# EAGLE design schematic (EAGLE 6.5.0)
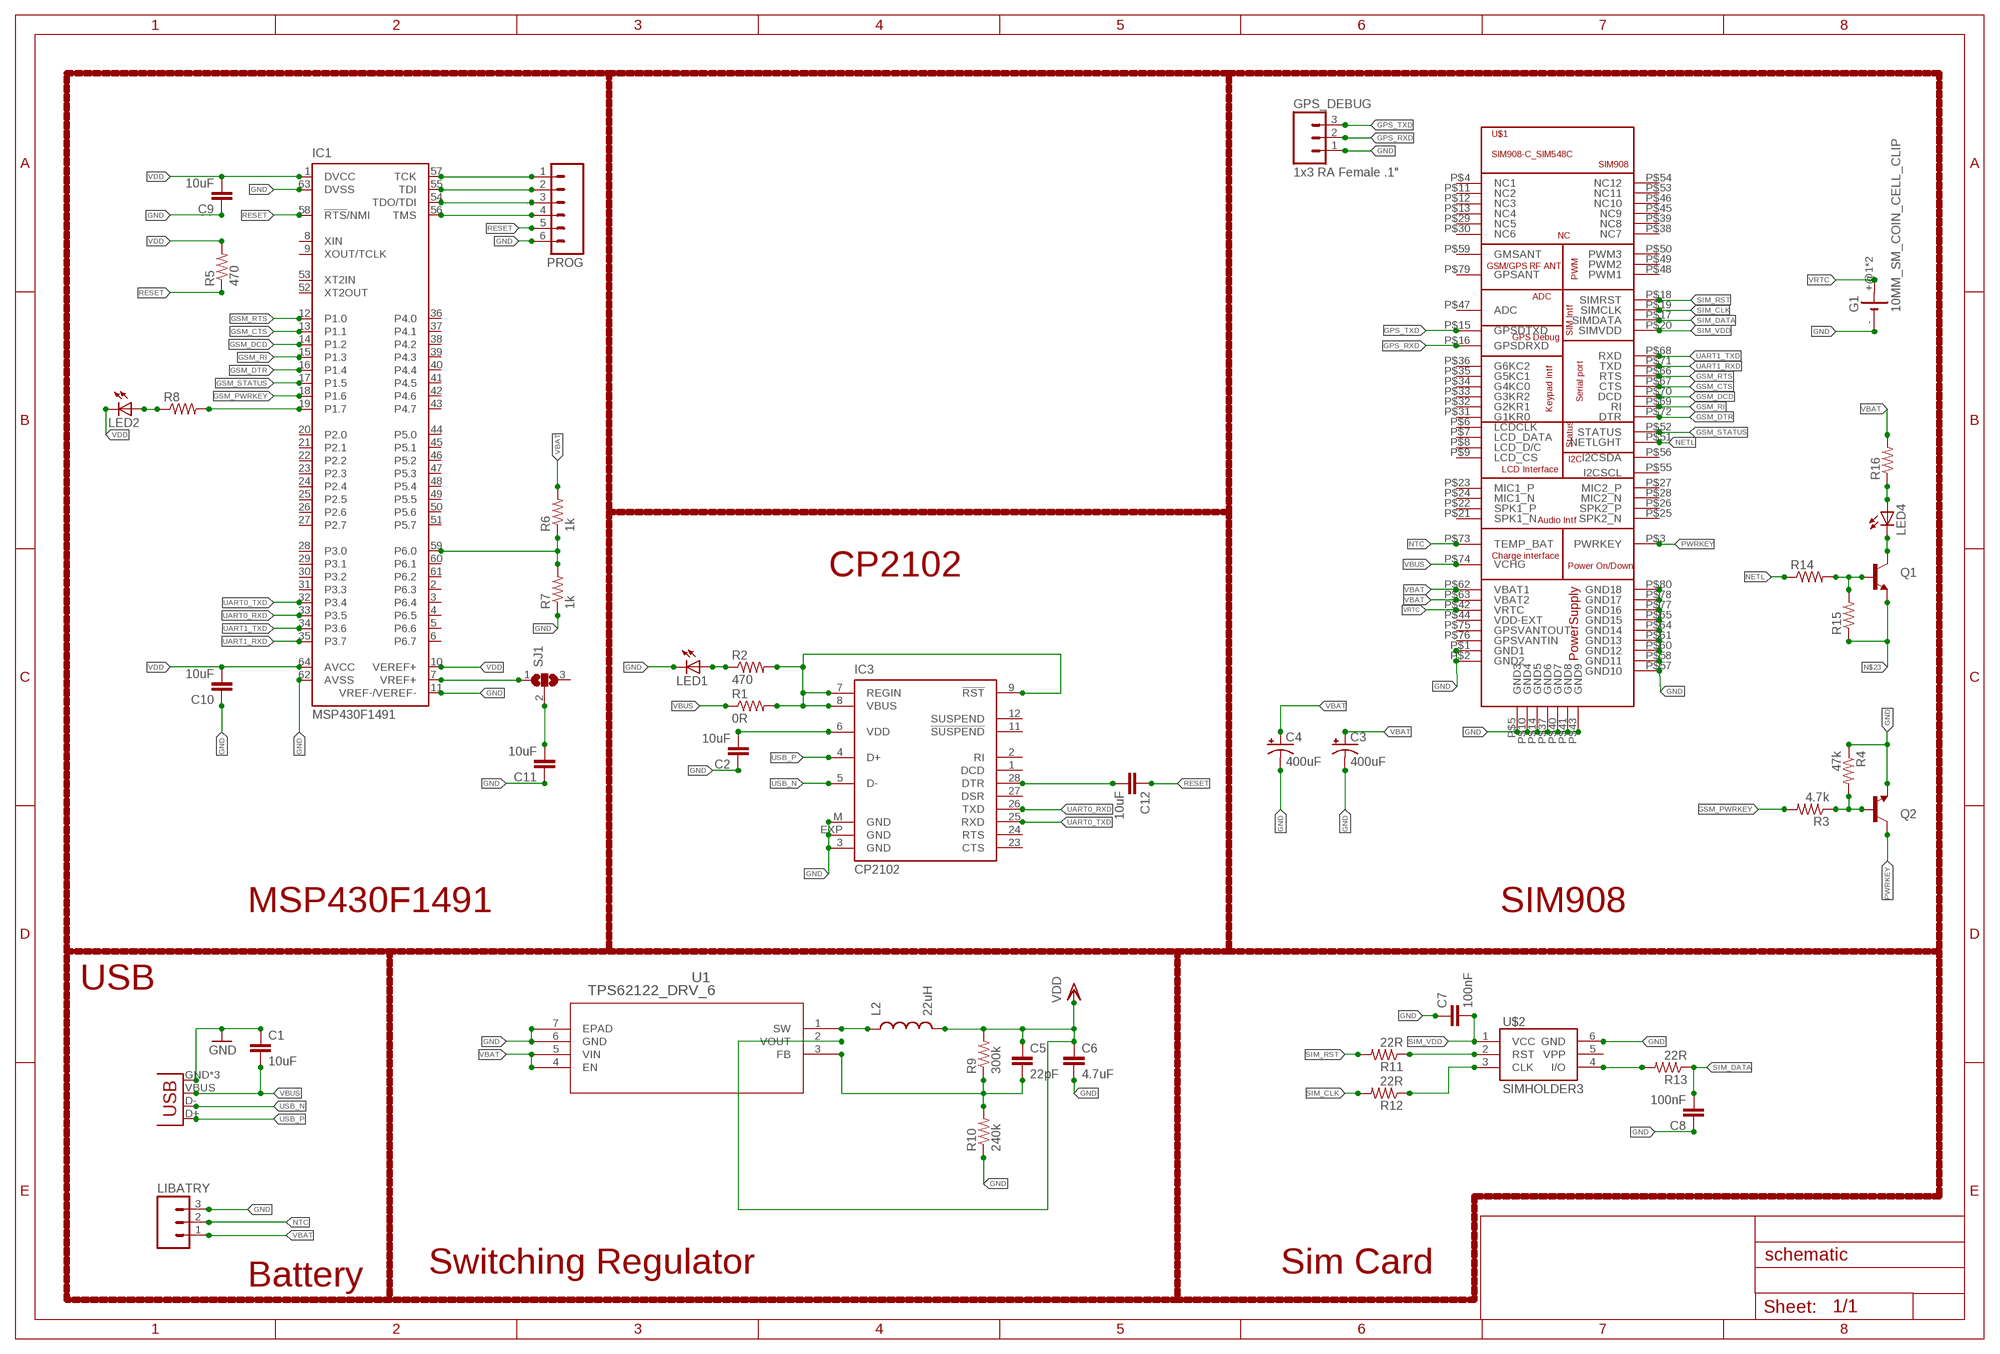
[diagram p0: schematic, sheet 1]

## Parts
C1  10uF  CAP0402-CAP  [0402-CAP]
C2  10uF  CAP0402-CAP  [0402-CAP]
C3  400uF  CAP_POLG  [PANASONIC_G]
C4  400uF  CAP_POLG  [PANASONIC_G]
C5  22pF  CAP0402-CAP  [0402-CAP]
C6  4.7uF  CAP0402-CAP  [0402-CAP]
C7  100nF  CAP0402-CAP  [0402-CAP]
C8  100nF  CAP0402-CAP  [0402-CAP]
C9  10uF  CAP0402-CAP  [0402-CAP]
C10  10uF  CAP0402-CAP  [0402-CAP]
C11  10uF  CAP0402-CAP  [0402-CAP]
C12  10uF  CAP0402-CAP  [0402-CAP]
G1  10MM_SM_COIN_CELL_CLIP  [10MM_SM_COIN_CELL_CLIP]
GPS_DEBUG  1x3 RA Female .1"  M03SMD_RA_FEMALE  [1X03_SMD_RA_FEMALE]
IC1  MSP430F1491  [SQFP-S-10X10-64]
IC3  CP2102  [MLP28]
JP1  USB-MICROB  [USB-MICROB]
L2  22uH  INDUCTOR0402  [C0402]
LED1  LEDSML0603  [SML0603]
LED2  LEDSML0603  [SML0603]
LED4  LEDSML0603  [SML0603]
LIBATRY  M03PTH  [1X03]
PROG  M06SMD-STRAIGHT  [1X06_SMD_STRAIGHT]
Q1  TRANSISTOR_NPNSOT23  [SOT23]
Q2  TRANSISTOR_NPNSOT23  [SOT23]
R1  0R  RESISTOR0402-RES  [0402-RES]
R2  470  RESISTOR0402-RES  [0402-RES]
R3  4.7k  RESISTOR0402-RES  [0402-RES]
R4  47k  RESISTOR0402-RES  [0402-RES]
R5  470  RESISTOR0402-RES  [0402-RES]
R6  1k  RESISTOR0402-RES  [0402-RES]
R7  1k  RESISTOR0402-RES  [0402-RES]
R8  RESISTOR0402-RES  [0402-RES]
R9  300k  RESISTOR0402-RES  [0402-RES]
R10  240k  RESISTOR0402-RES  [0402-RES]
R11  22R  RESISTOR0402-RES  [0402-RES]
R12  22R  RESISTOR0402-RES  [0402-RES]
R13  22R  RESISTOR0402-RES  [0402-RES]
R14  RESISTOR0402-RES  [0402-RES]
R15  RESISTOR0402-RES  [0402-RES]
R16  RESISTOR0402-RES  [0402-RES]
SJ1  SJ2W  [SJ_2]
U1  TPS62122_DRV_6  [DRV6_1P6X1]
U$1  SIM908-C_SIM548C  [SIM908-C_SIM548C]
U$2  SIMHOLDER3  [SIMHOLDER3]

## Nets
GND: C1.1 C2.1 C3.- C4.- C6.2 C7.1 C8.1 C9.1 C10.1 C11.1 G1.- GPS_DEBUG.1 IC1.11(VREF-/VEREF-) IC1.62(AVSS) IC1.63(DVSS) IC3.3(GND) IC3.EXP(GND) IC3.M(GND) JP1.GND JP1.MT1(GND) JP1.MT2(GND) LED1.C LIBATRY.3 PROG.6 Q2.2(E) R4.1 R7.1 R10.1 U1.6(GND) U1.7(EPAD) U$1.P$1(GND1) U$1.P$2(GND2) U$1.P$5(GND3) U$1.P$10(GND4) U$1.P$14(GND5) U$1.P$37(GND6) U$1.P$40(GND7) U$1.P$41(GND8) U$1.P$43(GND9) U$1.P$57(GND10) U$1.P$58(GND11) U$1.P$60(GND12) U$1.P$61(GND13) U$1.P$64(GND14) U$1.P$65(GND15) U$1.P$77(GND16) U$1.P$78(GND17) U$1.P$80(GND18) U$2.6(GND)
GPS_RXD: GPS_DEBUG.2 U$1.P$16(GPSDRXD)
GPS_TXD: GPS_DEBUG.3 U$1.P$15(GPSDTXD)
GSM_CTS: IC1.13(P1.1) U$1.P$67(CTS)
GSM_DCD: IC1.14(P1.2) U$1.P$70(DCD)
GSM_DTR: IC1.16(P1.4) U$1.P$72(DTR)
GSM_PWRKEY: IC1.18(P1.6) R3.2
GSM_RI: IC1.15(P1.3) U$1.P$69(RI)
GSM_RTS: IC1.12(P1.0) U$1.P$66(RTS)
GSM_STATUS: IC1.17(P1.5) U$1.P$52(STATUS)
N$1: IC1.57(TCK) PROG.1
N$2: IC1.7(VREF+) SJ1.1
N$3: IC1.55(TDI) PROG.2
N$4: LED4.C Q1.3(C)
N$5: LED1.A R2.1
N$6: IC1.54(TDO/TDI) PROG.3
N$7: LED4.A R16.1
N$8: Q2.1(B) R3.1 R4.2
N$9: IC1.56(TMS) PROG.4
N$10: R11.1 U$2.2(RST)
N$11: C2.2 IC3.6(VDD)
N$12: L2.1 U1.1(SW)
N$13: LED2.A R8.1
N$14: C11.2 SJ1.2
N$15: IC3.7(REGIN) IC3.8(VBUS) IC3.9(!RST) R1.2 R2.2
N$16: R12.1 U$2.3(CLK)
N$17: R13.2 U$2.4(I/O)
N$19: C5.2 R9.1 R10.2 U1.3(FB)
N$20: IC1.59(P6.0) R6.1 R7.2
N$21: C12.2 IC3.28(DTR)
N$23: Q1.2(E) R15.1
N$24: Q1.1(B) R14.2 R15.2
N$25: IC1.19(P1.7) R8.2
NETL: R14.1 U$1.P$51(NETLGHT)
NTC: LIBATRY.2 U$1.P$73(TEMP_BAT)
PWRKEY: Q2.3(C) U$1.P$3(PWRKEY)
RESET: C12.1 IC1.58(!RTS!/NMI) PROG.5 R5.1
SIM_CLK: R12.2 U$1.P$19(SIMCLK)
SIM_DATA: C8.2 R13.1 U$1.P$17(SIMDATA)
SIM_RST: R11.2 U$1.P$18(SIMRST)
SIM_VDD: C7.2 U$1.P$20(SIMVDD) U$2.1(VCC)
UART0_RXD: IC1.33(P3.5) IC3.26(TXD)
UART0_TXD: IC1.32(P3.4) IC3.25(RXD)
UART1_RXD: IC1.35(P3.7) U$1.P$71(TXD)
UART1_TXD: IC1.34(P3.6) U$1.P$68(RXD)
USB_N: IC3.5(D-) JP1.D-
USB_P: IC3.4(D+) JP1.D+
VBAT: C3.+ C4.+ LIBATRY.1 R6.2 R16.2 U1.4(EN) U1.5(VIN) U$1.P$62(VBAT1) U$1.P$63(VBAT2)
VBUS: C1.2 JP1.VBUS R1.1 U$1.P$74(VCHG)
VDD: C5.1 C6.1 C9.2 C10.2 IC1.1(DVCC) IC1.10(VEREF+) IC1.64(AVCC) L2.2 LED2.C R5.2 R9.2 U1.2(VOUT)
VRTC: G1.+@1(+) G1.+@2(+) U$1.P$42(VRTC)
Unconnected: IC1.2(P6.3) IC1.3(P6.4) IC1.4(P6.5) IC1.5(P6.6) IC1.6(P6.7) IC1.8(XIN) IC1.9(XOUT/TCLK) IC1.20(P2.0) IC1.21(P2.1) IC1.22(P2.2) IC1.23(P2.3) IC1.24(P2.4) IC1.25(P2.5) IC1.26(P2.6) IC1.27(P2.7) IC1.28(P3.0) IC1.29(P3.1) IC1.30(P3.2) IC1.31(P3.3) IC1.36(P4.0) IC1.37(P4.1) IC1.38(P4.2) IC1.39(P4.3) IC1.40(P4.4) IC1.41(P4.5) IC1.42(P4.6) IC1.43(P4.7) IC1.44(P5.0) IC1.45(P5.1) IC1.46(P5.2) IC1.47(P5.3) IC1.48(P5.4) IC1.49(P5.5) IC1.50(P5.6) IC1.51(P5.7) IC1.52(XT2OUT) IC1.53(XT2IN) IC1.60(P6.1) IC1.61(P6.2) IC3.1(DCD) IC3.2(RI) IC3.11(!SUSPEND) IC3.12(SUSPEND) IC3.23(CTS) IC3.24(RTS) IC3.27(DSR) SJ1.3 U$1.P$4(NC1) U$1.P$6(LCDCLK) U$1.P$7(LCD_DATA) U$1.P$8(LCD_D/C) U$1.P$9(LCD_CS) U$1.P$11(NC2) U$1.P$12(NC3) U$1.P$13(NC4) U$1.P$21(SPK1_N) U$1.P$22(SPK1_P) U$1.P$23(MIC1_P) U$1.P$24(MIC1_N) U$1.P$25(SPK2_N) U$1.P$26(SPK2_P) U$1.P$27(MIC2_P) U$1.P$28(MIC2_N) U$1.P$29(NC5) U$1.P$30(NC6) U$1.P$31(G1KR0) U$1.P$32(G2KR1) U$1.P$33(G3KR2) U$1.P$34(G4KC0) U$1.P$35(G5KC1) U$1.P$36(G6KC2) U$1.P$38(NC7) U$1.P$39(NC8) U$1.P$44(VDD-EXT) U$1.P$45(NC9) U$1.P$46(NC10) U$1.P$47(ADC) U$1.P$48(PWM1) U$1.P$49(PWM2) U$1.P$50(PWM3) U$1.P$53(NC11) U$1.P$54(NC12) U$1.P$55(I2CSCL) U$1.P$56(I2CSDA) U$1.P$59(GMSANT) U$1.P$75(GPSVANTOUT) U$1.P$76(GPSVANTIN) U$1.P$79(GPSANT) U$2.5(VPP)

## Notes on the sheet
- CP2102
- MSP430F1491 | SIM908
- USB
- Switching Regulator | Sim Card
- Battery

## Library data of the parts
C1 C2 C5-C12 = SparkFun-Capacitors:CAP: Capacitor Standard 0603 ceramic capacitor, and 0.1" leaded capacitor.
C3 C4 = SparkFun-Capacitors:CAP_POL: Capacitor Polarized These are standard SMD and PTH capacitors. Normally 10uF, 47uF, and 100uF in electrolytic and tantalum varieties. Always verify the external diameter of the through hole cap, it varies with capacity, voltage, and manufacturer. The EIA devices should be standard.
G1 = battery:10MM_SM_COIN_CELL_CLIP: Battery cell clip for CR927 Source: KEYSTONE ELECTRONICS CORP. www.keyelco.com, ASTORIA, N.Y. 11105-2017 PART ANME 10mm SM COIN CELl CLIP DWG NO. 3030
GPS_DEBUG = SparkFun-Connectors:M03: Header 3 Standard 3-pin 0.1" header. Use with straight break away headers (SKU : PRT-00116), right angle break away headers (PRT-00553), swiss pins (PRT-00743), machine pins (PRT-00117), and female headers (PRT-00115). Molex polarized connector foot print use with SKU : PRT-08232 with associated crimp pins and housings.; PROD_ID: CONN-10926
IC1 = texas:MSP430F1*: MIXED SIGNAL MICROCONTROLLER Family Members Include: - MSP430F133: 8KB+256B Flash Memory, 256B RAM - MSP430F135: 16KB+256B Flash Memory, 512B RAM - MSP430F147, MSP430F1471: 32KB+256B Flash Memory, 1KB RAM - MSP430F148, MSP430F1481: 48KB+256B Flash Memory, 2KB RAM - MSP430F149, MSP430F1491: 60KB+256B Flash Memory, 2KB RAM; MF: TEXAS INSTRUMENT CONNECTORS; MPN: MSP430F1491IPM; OC_FARNELL: 1537169; OC_NEWARK: 34K8186
IC3 = silabs:CP210*: Single-Chip USB to UART Bridge Source: www.silabs.com .. CP2101.pdf / cp2102.pdf; MF: FARNELL; MPN: CP2102-GM; OC_FARNELL: 9282130; OC_NEWARK: 30K5635
JP1 = SparkFun-Connectors:USB: USB Connectors USB-B-PTH is fully proven SKU : PRT-00139/CONN-08278 USB-miniB is fully proven SKU : PRT-00587 USB-A-PCB is untested. USB-A-H is throughly reviewed, but untested. Spark Fun Electronics SKU : PRT-00437 USB-B-SMT is throughly reviewed, but untested. Needs silkscreen touching up. USB-A-S has not been used/tested USB-MB-H has not been used/tested USB-MICROB has been used. CONN-09505; PROD_ID: CONN-09505
L2 = SparkFun-Passives:INDUCTOR: Inductors Basic Inductor/Choke - 0603 and 1206. Footprints are not proven and vary greatly between part numbers. SRN6045- 33uH, 20% 1.4A SDR0403-560KL - 56uH, 10%, 500mA RMS/740mA peak
LED1 LED2 LED4 = led:LED: LED OSRAM: - CHIPLED LG R971, LG N971, LY N971, LG Q971, LY Q971, LO R971, LY R971 LH N974, LH R974 LS Q976, LO Q976, LY Q976 LO Q996 - Hyper CHIPLED LW Q18S LB Q993, LB Q99A, LB R99A - SideLED LS A670, LO A670, LY A670, LG A670, LP A670 LB A673, LV A673, LT A673, LW A673 LH A674 LY A675 LS A676, LA A676, LO A676, LY A676, LW A676 LS A679, LY A679, LG A679 - Hyper Micro SIDELED® LS Y876, LA Y876, LO Y876, LY Y876 LT Y87S - SmartLED LW L88C, LW L88S LB L89C, LB L89S, LG L890 LS L89K, LO L89K, LY L89K LS L896, LA L896, LO L896, LY L896 - TOPLED LS T670, LO T670, LY T670, LG T670, LP T670 LSG T670, LSP T670, LSY T670, LOP T670, LYG T670 LG T671, LOG T671, LSG T671 LB T673, LV T673, LT T673, LW T673 LH T674 LS T676, LA T676, LO T676, LY T676, LB T676, LH T676, LSB T676, LW T676 LB T67C, LV T67C, LT T67C, LS T67K, LO T67K, LY T67K, LW E67C LS E67B, LA E67B, LO E67B, LY E67B, LB E67C, LV E67C, LT E67C LW T67C LS T679, LY T679, LG T679 LS T770, LO T770, LY T770, LG T770, LP T770 LB T773, LV T773, LT T773, LW T773 LH T774 LS E675, LA E675, LY E675, LS T675 LS T776, LA T776, LO T776, LY T776, LB T776 LHGB T686 LT T68C, LB T68C - Hyper Mini TOPLED® LB M676 - Mini TOPLED Santana® LG M470 LS M47K, LO M47K, LY M47K Source: http://www.osram.convergy.de LUXEON: - LUMILED® LXK2-PW12-R00, LXK2-PW12-S00, LXK2-PW14-U00, LXK2-PW14-V00 LXK2-PM12-R00, LXK2-PM12-S00, LXK2-PM14-U00 LXK2-PE12-Q00, LXK2-PE12-R00, LXK2-PE12-S00, LXK2-PE14-T00, LXK2-PE14-U00 LXK2-PB12-K00, LXK2-PB12-L00, LXK2-PB12-M00, LXK2-PB14-N00, LXK2-PB14-P00, LXK2-PB14-Q00 LXK2-PR12-L00, LXK2-PR12-M00, LXK2-PR14-Q00, LXK2-PR14-R00 LXK2-PD12-Q00, LXK2-PD12-R00, LXK2-PD12-S00 LXK2-PH12-R00, LXK2-PH12-S00 LXK2-PL12-P00, LXK2-PL12-Q00, LXK2-PL12-R00 Source: www.luxeon.com KINGBRIGHT: KA-3528ASYC Source: www.kingbright.com
LIBATRY = SparkFun-Connectors:M03: Header 3 Standard 3-pin 0.1" header. Use with straight break away headers (SKU : PRT-00116), right angle break away headers (PRT-00553), swiss pins (PRT-00743), machine pins (PRT-00117), and female headers (PRT-00115). Molex polarized connector foot print use with SKU : PRT-08232 with associated crimp pins and housings.
PROG = SparkFun-Connectors:M06: Header 6 Standard 6-pin 0.1" header. Use with straight break away headers (SKU : PRT-00116), right angle break away headers (PRT-00553), swiss pins (PRT-00743), machine pins (PRT-00117), and female headers (PRT-00115). Molex polarized connector foot print use with SKU : PRT-08094 with associated crimp pins and housings. NOTES ON THE VARIANTS LOCK and LOCK_LONGPADS... This footprint was designed to help hold the alignment of a through-hole component (i.e. 6-pin header) while soldering it into place. You may notice that each hole has been shifted either up or down by 0.005 of an inch from it's more standard position (which is a perfectly straight line). This slight alteration caused the pins (the squares in the middle) to touch the edges of the holes. Because they are alternating, it causes a "brace" to hold the component in place. 0.005 has proven to be the perfect amount of "off-center" position when using our standard breakaway headers. Although looks a little odd when you look at the bare footprint, once you have a header in there, the alteration is very hard to notice. Also,if you push a header all the way into place, it is covered up entirely on the bottom side. This idea of altering the position of holes to aid alignment will be further integrated into the Sparkfun Library for other footprints. It can help hold any component with 3 or more connection pins.
Q1 Q2 = SparkFun-DiscreteSemi:TRANSISTOR_NPN: Generic NPN BJT MMBT2222A - TRANS-08049 (SOT-23, 1A 40V) MPSA42 - TRANS-09116 (SOT-23, 500mA 300V) MMBT5088LT1G - TRANS-11160 (SOT-23, 50 mA 30V) BC547 - COM-08928 <http://www.sparkfun.com/products/8928> (TO-92 45V 100mA) (1.Collector 2.Base 3.Emitter) 2N3904 - COM-00521 <http://www.sparkfun.com/products/521> (TO-92 40V 200mA) (1.Emitter 2.Base 3.Collector) P2N2222A - COM-12852 <http://www.sparkfun.com/products/12852> (TO-92 40V 600mA) (1.Collector 2.Base 3.Emitter)
R1-R7 R14 R15 = SparkFun-Passives:RESISTOR: Resistor Basic schematic elements and footprints for 0603, 1206, and PTH resistors.
R8-R13 R16 = SparkFun:RESISTOR: Resistor Basic schematic elements and footprints for 0603, 1206, and PTH resistors.
SJ1 = jumper:SJ2W: SMD solder JUMPER
U1 = myTracelib:TPS62122_DRV_6; DATASHEETURL: http://www.ti.com/lit/gpn/TPS62122; DESCRIPTION: 15V, 75mA, 96% efficiency Step-Down Converter; FAMILY_NAME: STEP-DOWN REGULATOR; GENERIC_PART_NUMBER: TPS62122; INDUSTRY_STD_PKG_TYPE: SON; MANUFACTURER: Texas Instruments; MANUFACTURER_PART_NUMBER: tps62122_drv_6; PACKAGE_DESIGNATOR: DRV; PIN_COUNT: 6; VENDOR: Texas Instruments
U$1 = myTracelib:SIM908-C_SIM548C
U$2 = SparkFun-Connectors:SIMHOLDER3: Alternate SIM card socket

## Net classes
0 default: width 0.203 mm, drill 0.305 mm, clearance 0.152 mm

## Board
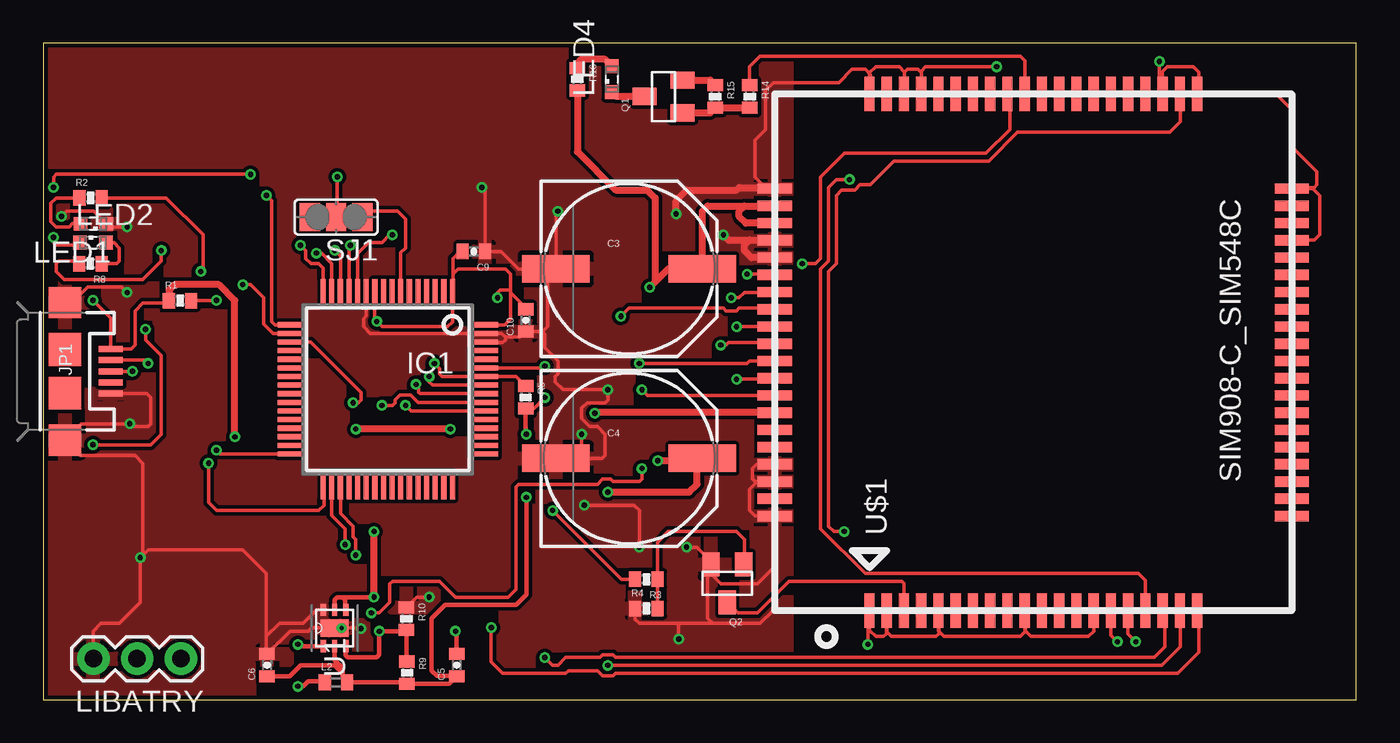
[diagram p1: board, top side]
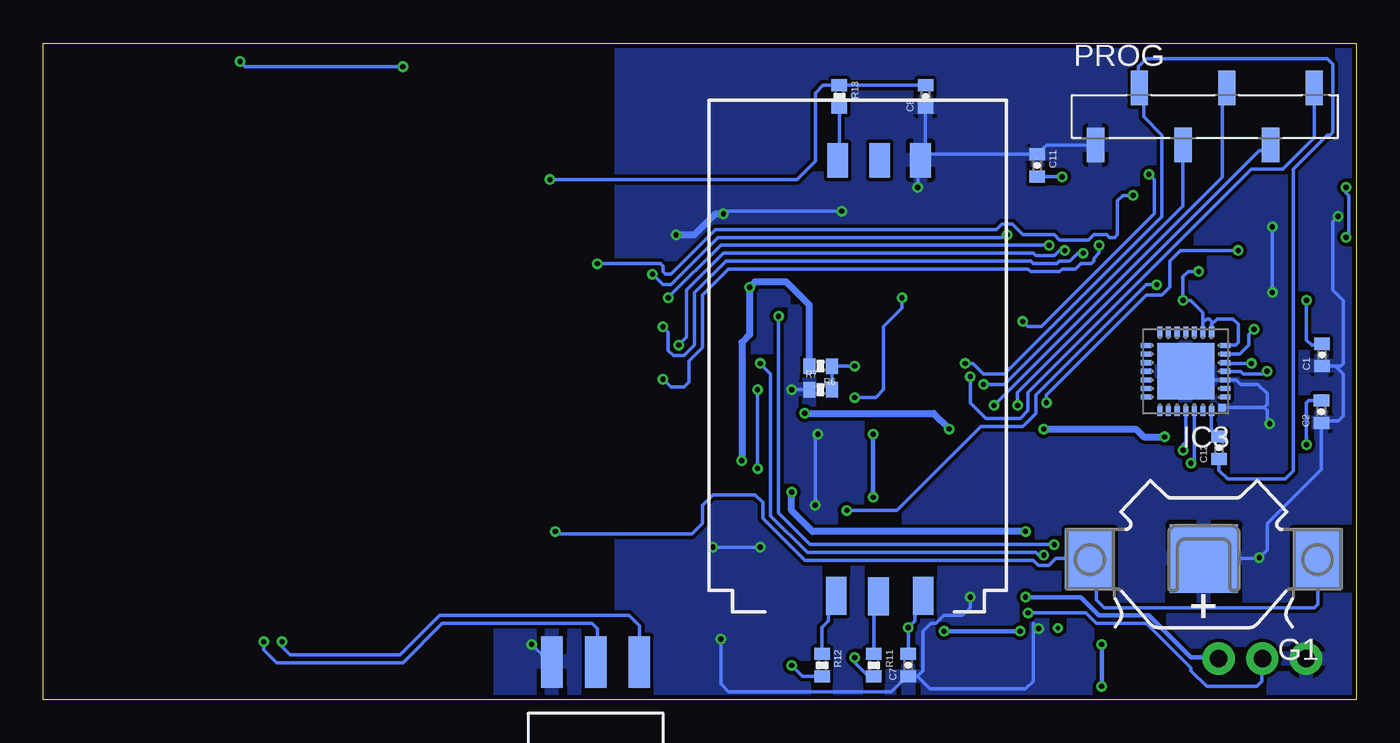
[diagram p2: board, bottom side, seen from below]

Size 76.2 x 38.1 mm. Coordinates in mm from the lower left corner, seen from the top.
Outline: 0,0 76.2,0 76.2,38.1 0,38.1 0,0
Copper layers (1*16): Top 0.035mm / dielectric 1.5mm / Bottom 0.035mm
Design rules "smart prototyping": minimum track width 6mil, minimum drill 12mil, track to track 6mil, track to pad 6mil, pad to pad 6mil, via to via 6mil, smd to smd 0mil, copper to edge 10mil, drill to drill 10mil, minimum pad ring 6mil, minimum via ring 6mil, stop-mask expansion 2mil, vias tented up to drill 25mil, thermal gap 10mil

### Footprints (pad centres in the part's own frame; a part is rotated, then mirrored left to right if it is on the bottom)
0402-CAP = smd 0.7 x 0.9: 1 -0.65,0; 2 0.65,0
PANASONIC_G = smd 3.9 x 1.6: + 4.25,0; - -4.25,0
10MM_SM_COIN_CELL_CLIP = smd 2.9 x 3.5: +@1 -6.6,0; +@2 6.6,0 | smd 3.96 x 3.96: - 0,0
1X03_SMD_RA_FEMALE = smd 1.25 x 3: 1 -2.54,7.225; 2 0,7.225; 3 2.54,7.225
SQFP-S-10X10-64 = smd 0.3 x 1.6: 1 -3.75,-5.6; 2 -3.25,-5.6; 3 -2.75,-5.6; 4 -2.25,-5.6; 5 -1.75,-5.6; 6 -1.25,-5.6; 7 -0.75,-5.6; 8 -0.25,-5.6; 9 0.25,-5.6; 10 0.75,-5.6; 11 1.25,-5.6; 12 1.75,-5.6; 13 2.25,-5.6; 14 2.75,-5.6; 15 3.25,-5.6; 16 3.75,-5.6; 33 3.75,5.6; 34 3.25,5.6; 35 2.75,5.6; 36 2.25,5.6; 37 1.75,5.6; 38 1.25,5.6; 39 0.75,5.6; 40 0.25,5.6; 41 -0.25,5.6; 42 -0.75,5.6; 43 -1.25,5.6; 44 -1.75,5.6; 45 -2.25,5.6; 46 -2.75,5.6; 47 -3.25,5.6; 48 -3.75,5.6 | smd 1.6 x 0.3: 17 5.6,-3.75; 18 5.6,-3.25; 19 5.6,-2.75; 20 5.6,-2.25; 21 5.6,-1.75; 22 5.6,-1.25; 23 5.6,-0.75; 24 5.6,-0.25; 25 5.6,0.25; 26 5.6,0.75; 27 5.6,1.25; 28 5.6,1.75; 29 5.6,2.25; 30 5.6,2.75; 31 5.6,3.25; 32 5.6,3.75; 49 -5.6,3.75; 50 -5.6,3.25; 51 -5.6,2.75; 52 -5.6,2.25; 53 -5.6,1.75; 54 -5.6,1.25; 55 -5.6,0.75; 56 -5.6,0.25; 57 -5.6,-0.25; 58 -5.6,-0.75; 59 -5.6,-1.25; 60 -5.6,-1.75; 61 -5.6,-2.25; 62 -5.6,-2.75; 63 -5.6,-3.25; 64 -5.6,-3.75
MLP28 = smd 0.6 x 0.3: 1 -2.3,1.5; 2 -2.3,1; 3 -2.3,0.5; 4 -2.3,0; 5 -2.3,-0.5; 6 -2.3,-1; 7 -2.3,-1.5; 15 2.3,-1.5; 16 2.3,-1; 17 2.3,-0.5; 18 2.3,0; 19 2.3,0.5; 20 2.3,1; 21 2.3,1.5 | smd 0.3 x 0.6: 8 -1.5,-2.3; 9 -1,-2.3; 10 -0.5,-2.3; 11 0,-2.3; 12 0.5,-2.3; 13 1,-2.3; 14 1.5,-2.3; 22 1.5,2.3; 23 1,2.3; 24 0.5,2.3; 25 0,2.3; 26 -0.5,2.3; 27 -1,2.3; 28 -1.5,2.3 | smd 3.3 x 3.3: EXP 0,0 | smd 0.435 x 0.435: M -2.103,2.103
USB-MICROB = smd 0.35 x 1.4: D+ 0,2.65; D- -0.65,2.65; GND 1.3,2.65; ID 0.65,2.65; VBUS -1.3,2.65 | smd 1.8 x 1.9: MT1 -4,0; MT2 4,0 | smd 1.9 x 1.9: P$1 -1.27,0; P$2 1.27,0
C0402 = smd 0.7 x 0.9: 1 -0.65,0; 2 0.65,0
SML0603 = smd 0.8 x 0.8: A 0.75,0; C -0.75,0
1X03 = drill 1.016 pad 1.88: 1 0,0; 2 2.54,0; 3 5.08,0
1X06_SMD_STRAIGHT = smd 1 x 2: 1 0,1.65; 2 -2.54,-1.65; 3 -5.08,1.65; 4 -7.62,-1.65; 5 -10.16,1.65; 6 -12.7,-1.65
SOT23 = smd 1 x 1.4: 1 -0.95,-1.1; 2 0.95,-1.1; 3 0,1.1
0402-RES = smd 0.7 x 0.9: 1 -0.65,0; 2 0.65,0
SJ_2 = smd 1.168 x 1.6: 1 -1.524,0; 2 0,0; 3 1.524,0
DRV6_1P6X1 = smd 0.711 x 0.305: 1 -1.05,0.65; 2 -1.05,0; 3 -1.05,-0.65; 4 1.05,-0.65; 5 1.05,0; 6 1.05,0.65 | smd 1.016 x 1.6: 7 0,0 | drill 0.254: V 0,-0.406
SIM908-C_SIM548C = smd 2 x 0.6: P$1 -15,9; P$2 -15,8; P$3 -15,7; P$4 -15,6; P$5 -15,5; P$6 -15,4; P$7 -15,3; P$8 -15,2; P$9 -15,1; P$10 -15,0; P$11 -15,-1; P$12 -15,-2; P$13 -15,-3; P$14 -15,-4; P$15 -15,-5; P$16 -15,-6; P$17 -15,-7; P$18 -15,-8; P$19 -15,-9; P$20 -15,-10; P$41 15,-10; P$42 15,-9; P$43 15,-8; P$44 15,-7; P$45 15,-6; P$46 15,-5; P$47 15,-4; P$48 15,-3; P$49 15,-2; P$50 15,-1; P$51 15,0; P$52 15,1; P$53 15,2; P$54 15,3; P$55 15,4; P$56 15,5; P$57 15,6; P$58 15,7; P$59 15,8; P$60 15,9 | smd 0.6 x 2: P$21 -9.5,-15.5; P$22 -8.5,-15.5; P$23 -7.5,-15.5; P$24 -6.5,-15.5; P$25 -5.5,-15.5; P$26 -4.5,-15.5; P$27 -3.5,-15.5; P$28 -2.5,-15.5; P$29 -1.5,-15.5; P$30 -0.5,-15.5; P$31 0.5,-15.5; P$32 1.5,-15.5; P$33 2.5,-15.5; P$34 3.5,-15.5; P$35 4.5,-15.5; P$36 5.5,-15.5; P$37 6.5,-15.5; P$38 7.5,-15.5; P$39 8.5,-15.5; P$40 9.5,-15.5; P$61 9.5,14.5; P$62 8.5,14.5; P$63 7.5,14.5; P$64 6.5,14.5; P$65 5.5,14.5; P$66 4.5,14.5; P$67 3.5,14.5; P$68 2.5,14.5; P$69 1.5,14.5; P$70 0.5,14.5; P$71 -0.5,14.5; P$72 -1.5,14.5; P$73 -2.5,14.5; P$74 -3.5,14.5; P$75 -4.5,14.5; P$76 -5.5,14.5; P$77 -6.5,14.5; P$78 -7.5,14.5; P$79 -8.5,14.5; P$80 -9.5,14.5
SIMHOLDER3 = smd 2.2 x 1.2: 1 0.95,4.81; 2 0.91,7.41; 3 0.95,9.86 | smd 2 x 1.2: 4 26.2,9.78; 5 26.22,7.34; 6 26.22,4.98

### Placement (x,y rotation side)
C1  2,20 90 bottom
C2  2.04,16.71 90 bottom
C3  34,25 0 top
C4  34,14 0 top
C5  24,2 90 top
C6  13,2 90 top
C7  26,2 90 bottom
C8  25,35 90 bottom
C9  25,26 180 top
C10  28,22 90 top
C11  18.52,31 270 bottom
C12  7.97,14.62 90 bottom
G1  8.86,8.18 180 bottom
GPS_DEBUG  44.14,-5.05 0 bottom
IC1  20,18 180 top
IC3  9.91,19.05 180 bottom
JP1  1.27,19.05 270 top
L2  17,1 0 top
LED1  2.91,27.61 180 top
LED2  2.9,26.52 0 top
LED4  33,36 90 top
LIBATRY  8,2.37 180 top
PROG  2.44,33.83 0 bottom
Q1  36,35 90 top
Q2  39.7,6.74 180 top
R1  7.95,23.15 0 top
R2  2.76,29.11 0 top
R3  35,6.98 180 top
R4  35,5.29 0 top
R5  28,17.54 270 top
R6  31.09,19.35 180 bottom
R7  31.09,17.98 0 bottom
R8  2.74,25.3 180 top
R9  21.12,1.56 270 top
R10  21.08,4.69 270 top
R11  28,2 270 bottom
R12  31,2 270 bottom
R13  30,35 270 bottom
R14  41,35 270 top
R15  39,35 270 top
R16  31,36 270 top
SJ1  17,28 180 top
U1  16.91,4.15 90 top
U$1  56.95,20.15 90 top
U$2  20.32,5.08 90 bottom

### Tracks (layer width: path | path; a pad name or v marks a point on that pad's centre or on a via)
GND  (via drill 0.3)
  Top 0.203: IC1.11 18.75,22.25 18.59,22.1 18.59,21.64 18.98,21.25 IC1.63 26.6,21.25 26.82,21.03 | 26.82,21.03 26.82,20.88 26.67,20.73 25.62,20.73 IC1.62 | 26.82,21.03 27.68,21.03 C10.1 28.97,21.35 | Q2.2 38.74,7.28 39.32,6.71 41.45,6.71 42.52,7.77 42.52,10.58 U$1.P$80 42.43,10.67 41.3,10.67 41,10.97 41,12.19 41.45,12.65 U$1.P$78 41.3,12.65 41.15,12.8 41.15,13.41 41.39,13.65 U$1.P$77 | U$1.P$1 42.34,5.15 41.6,4.42 38.86,4.42 | 38.86,4.42 38.56,4.72 38.56,7.66 Q2.2 | R4.1 34.35,4.66 34.59,4.42 36.88,4.42 | 36.88,4.42 38.86,4.42 | v36.88,3.5 36.88,4.42 | v47.85,3.2 47.85,5.05 U$1.P$1 | U$1.P$1 47.95,4.02 48.31,3.66 48.77,3.66 48.92,3.81 48.92,5.12 U$1.P$2 48.95,3.93 49.23,3.66 51.82,3.66 51.97,3.81 51.97,5.13 U$1.P$5 51.95,3.98 52.27,3.66 56.69,3.66 57,3.96 57,5.1 U$1.P$10 56.95,4.01 57.3,3.66 60.66,3.66 60.96,3.96 U$1.P$14 | U$1.P$61 41.98,29.65 41.3,30.33 41.3,32.46 41.91,33.07 41.91,35.36 42.37,35.81 46.18,35.81 46.94,36.58 47.7,36.58 48.01,36.27 48.01,35.21 U$1.P$60 47.95,36.37 48.31,36.73 49.68,36.73 49.99,36.42 | 49.99,36.42 49.99,35.19 U$1.P$58 | 49.99,36.42 50.14,36.58 50.75,36.58 50.95,36.38 U$1.P$57 50.95,36.47 51.21,36.73 v55.32,36.73 | v64.77,37.03 64.77,35.33 U$1.P$43 64.95,36.45 65.23,36.73 66.75,36.73 67.06,36.42 67.06,35.26 U$1.P$41 71.53,35.15 72.39,34.29 72.39,32.16 73.91,30.63 73.91,29.87 73.76,29.72 72.52,29.72 U$1.P$40 73.68,29.65 74.07,29.26 74.07,26.98 73.76,26.67 72.47,26.67 U$1.P$37 | v25.45,29.72 25.65,29.52 C9.1 26.58,26 27.58,24.99 29.26,24.99 | 29.26,24.99 C3.- 29.75,28.23 v29.87,28.35 | 28.97,21.35 29.26,21.64 29.26,24.99
  Top 0.203: 28.97,21.35 29.11,21.21 29.11,20.42 29.87,19.66 29.87,18.9 29.72,18.75 29.72,18.44 30.18,17.98 v32.77,17.98 32.77,17.37 32.61,17.22 31.55,17.22 31.24,16.92 31.24,16.31 31.7,15.85 32.16,15.85 32.61,15.39 32.61,14.17 32.44,14 31.24,14 | C4.- 31.24,14 | Q2.2 38.74,8.04 37.95,8.84 v37.34,8.84 | v34.59,8.84 34.59,10.97 34.29,11.28 v31.39,11.28 | v31.24,15.39 31.24,14 | v22.4,5.94 21.68,5.94 R10.1 | v18.44,4.12 18.4,4.15 U1.7 15.58,4.15 15.39,3.96 14.33,3.96 13.72,3.35 13.7,3.35 C6.2 12.95,2.7 12.95,3.66 | U1.6 15.87,5.2 15.09,4.42 13.72,4.42 12.95,3.66 | v5.64,8.23 5.64,5.64 4.42,4.42 3.35,4.42 2.9,3.96 2.9,2.39 LIBATRY.3 | 12.95,3.66 12.95,7.32 11.58,8.69 6.1,8.69 v5.64,8.23 | v5.64,8.23 5.79,8.38 5.79,13.72 5.33,14.17 2.15,14.17 JP1.MT2 2.22,16 v5.03,16 5.18,15.85 6.1,15.85 6.25,16 6.25,17.53 6.02,17.75 JP1.GND | v1.07,28.04 1.37,28.35 2.93,28.35 LED1.C 3.84,27.43 v4.88,27.43 | JP1.MT1 1.71,23.05 2.59,23.93 4.57,23.93 v4.88,23.62
  Top 0.406: U$1.P$65 41.1,25.65 40.69,26.06 40.69,26.36 41,26.67 42.43,26.67 U$1.P$64 39.8,26.65 v39.47,26.98 | v36.73,28.19 36.73,28.96 37.34,29.57 40.23,29.57 40.39,29.72 42.38,29.72 U$1.P$61
  Bottom 0.203: v36.88,3.5 36.88,0.91 36.42,0.46 26.98,0.46 26.08,1.35 C7.1 25.47,1.35 | GPS_DEBUG.1 46.83,2.18 v47.85,3.2 | v55.32,36.73 64.47,36.73 v64.77,37.03 | PROG.6 17.99,32.18 C11.1 24.95,31.65 | 24.95,31.65 U$2.6 25.45,31.15 v25.45,29.72 | C8.1 25,31.7 24.95,31.65 | v29.87,28.35 36.58,28.35 v36.73,28.19 | R7.1 v32.77,17.98 | v37.34,8.84 v34.59,8.84 | v31.39,11.28 31.39,15.24 v31.24,15.39 | 25.47,1.35 25.15,1.68 25.15,3.96 24.69,4.42 24.38,4.42 23.93,4.88 22.86,4.88 22.4,5.33 v22.4,5.94 | v18.44,4.12 18.75,4.42 18.75,1.07 19.2,0.61 24.73,0.61 25.47,1.35 | G1.- 5.69,8.18 v5.64,8.23 5.18,8.69 5.18,10.21 2.04,13.36 C2.1 1.95,16.15 1.07,16.15 0.76,16.46 0.76,18.9 1.21,19.35 | 4.97,16.06 v5.03,16 5.18,16.15 5.18,16.76 5.37,16.95 | IC3.M 5.37,16.95 | 5.37,16.95 5.18,17.13 5.18,17.75 5.72,18.29 6.71,18.29 6.97,18.55 IC3.3 9.41,18.55 IC3.EXP | C1.1 1.21,19.35 | 1.21,19.35 0.92,19.35 0.76,19.51 0.76,23.16 1.37,23.77 1.37,27.74 v1.07,28.04 | v4.88,23.62 v4.88,27.43
  Bottom 0.406: v39.47,26.98 38.41,26.98 37.19,28.19 v36.73,28.19
  pour Bottom (isolate 0.203): -1.83,39.62 42.67,39.62 42.67,4.27 49.68,4.27 49.68,-9.45 -1.83,-9.45
  pour Top (isolate 0.203): -4.11,42.52 43.13,42.52 43.13,-13.72 -4.11,-13.72
GPS_RXD  (via drill 0.3)
  Top 0.203: U$1.P$16 62.95,3.8 v63.4,3.35
  Bottom 0.203: v63.4,3.35 63.4,2.9 62.64,2.13 55.32,2.13 53.03,4.42 44.35,4.42 44.04,4.12 44.04,2.27 GPS_DEBUG.2
GPS_TXD  (via drill 0.3)
  Top 0.203: U$1.P$15 61.95,3.73 v62.33,3.35
  Bottom 0.203: v62.33,3.35 62.33,3.05 61.87,2.59 55.47,2.59 53.19,4.88 42.22,4.88 41.6,4.27 GPS_DEBUG.3
GSM_CTS  (via drill 0.3)
  Top 0.203: IC1.13 17.75,26.28 v17.83,26.36 | v39.93,23.32 40.39,23.32 40.69,23.62 42.42,23.62 U$1.P$67
  Bottom 0.203: v17.83,26.36 36.88,26.36 v39.93,23.32
GSM_DCD  (via drill 0.3)
  Top 0.203: IC1.14 17.25,25.73 v16.92,26.06 | v39.32,20.57 39.62,20.57 39.78,20.73 42.37,20.73 U$1.P$70
  Bottom 0.203: v16.92,26.06 17.22,26.06 17.53,25.76 18.59,25.76 18.75,25.91 36.73,25.91 38.86,23.77 38.86,21.03 v39.32,20.57
GSM_DTR  (via drill 0.3)
  Top 0.203: IC1.16 16.25,25.05 16,25.3 15.54,25.3 15.24,25.6 15.24,26.06 v14.94,26.36 | v40.23,18.59 42.39,18.59 U$1.P$72
  Bottom 0.203: v14.94,26.36 14.94,25.91 15.24,25.6 15.24,25.45 15.39,25.3 16,25.3 16.31,24.99 17.07,24.99 17.22,24.84 18.9,24.84 19.05,24.99 36.42,24.99 37.95,23.47 37.95,20.42 38.71,19.66 38.71,18.44 39.01,18.14 39.78,18.14 v40.23,18.59
GSM_PWRKEY  (via drill 0.3)
  Top 0.203: R3.2 33.56,6.98 v29.57,10.97 | v11.58,24.08 12.04,24.08 12.8,23.32 12.8,21.79 13.35,21.25 IC1.18
  Bottom 0.203: v29.57,10.97 26.67,10.97 21.79,15.85 19.36,15.85 18.59,16.61 18.59,17.68 12.19,24.08 v11.58,24.08
GSM_RI  (via drill 0.3)
  Top 0.203: IC1.15 16.75,25.31 16.15,25.91 v15.85,25.91 | v40.23,21.64 U$1.P$69
  Bottom 0.203: v15.85,25.91 16.15,25.91 16.61,25.45 17.22,25.45 17.37,25.3 18.75,25.3 18.9,25.45 36.58,25.45 38.41,23.62 38.41,20.57 39.01,19.96 39.62,19.96 39.93,20.27 39.93,21.34 v40.23,21.64
GSM_RTS  (via drill 0.3)
  Top 0.203: IC1.12 18.25,25.87 18.9,26.52 19.66,26.52 20.12,26.98 v20.27,26.98 | v40.84,24.69 42.41,24.69 U$1.P$66
  Bottom 0.203: v20.27,26.98 20.42,26.98 20.57,26.82 37.03,26.82 39.78,24.08 40.23,24.08 v40.84,24.69
GSM_STATUS  (via drill 0.3)
  Top 0.203: IC1.17 13.45,21.75 13.26,21.95 13.26,28.96 v12.95,29.26 | v44.04,25.3 44.81,25.3 45.11,25.6 45.11,30.33 46.48,31.7 54.71,31.7 56.08,33.07 56.08,35.02 U$1.P$52
  Bottom 0.203: v44.04,25.3 40.39,25.3 40.23,25.15 40.23,24.84 40.08,24.69 39.78,24.69 37.19,27.28 20.88,27.28 20.57,27.58 19.96,27.58 19.36,26.98 17.53,26.98 17.22,26.67 15.54,26.67 15.24,26.98 14.48,26.98 14.33,26.82 14.02,26.82 13.87,26.98 13.87,28.96 13.56,29.26 v12.95,29.26
N$1  (via drill 0.3)
  Top 0.203: IC1.57 22.59,18.25 22.4,18.44 v22.4,18.75
  Bottom 0.203: v22.4,18.75 22.4,17.22 21.49,16.31 19.51,16.31 19.05,16.76 19.05,17.83 6.1,30.79 4.27,30.79 2.44,32.61 PROG.1
N$2
  Top 0.203: IC1.7 20.75,25.93 21.03,26.21 21.03,27.89 20.57,28.35 18.87,28.35 SJ1.1
N$3  (via drill 0.3)
  Top 0.203: IC1.55 21.76,17.25 21.34,17.68 20.73,17.68 20.42,17.37 20.42,17.22 20.27,17.07 v19.66,17.07
  Bottom 0.203: v19.66,17.07 19.66,17.83 5.64,31.85 5.31,31.85 PROG.2
N$4
  Top 0.406: Q1.3 33.25,35 LED4.C
N$5
  Top 0.203: LED1.A 1.7,27.61 1.52,27.43 0.76,27.43 0.46,27.74 0.46,28.8 0.76,29.11 R2.1
N$6  (via drill 0.3)
  Top 0.203: IC1.54 21.35,16.75 v21.03,17.07
  Bottom 0.203: v21.03,17.07 7.77,30.33 7.77,35.23 PROG.3
N$7
  Top 0.406: R16.1 31,36.94 31.24,37.19 32.56,37.19 LED4.A
N$8
  Top 0.203: Q2.1 40.69,7.89 40.69,9.3 40.23,9.75 36.27,9.75 35.65,9.13 R3.1 R4.2
N$9  (via drill 0.3)
  Top 0.203: IC1.56 21.87,17.75 21.79,17.83 21.79,18.14 v21.64,18.29
  Bottom 0.203: v21.64,18.29 20.42,18.29 10.06,28.65 PROG.4
N$10
  Bottom 0.203: R11.1 28,5.72 U$2.2
N$11  (via drill 0.3)
  Top 0.203: v5.94,21.49 5.94,20.88 6.86,19.96 6.86,15.39 6.25,14.78 v2.9,14.78
  Bottom 0.203: IC3.6 6.77,20.05 6.25,20.57 6.25,21.18 v5.94,21.49 | C2.2 2.75,17.36 2.9,17.22 v2.9,14.78
N$12  (via drill 0.3)
  Top 0.254: U1.1 14.88,3.1 v14.78,3.2 | v14.78,0.76 15.09,0.76 15.39,1.07 16.28,1.07 L2.1
  Bottom 0.254: v14.78,3.2 v14.78,0.76
N$13
  Top 0.203: LED2.A 4.12,26.52 4.42,26.21 4.42,25.45 4.27,25.3 R8.1
N$14  (via drill 0.3)
  Top 0.203: v17.07,30.33 17.07,28.07 SJ1.2
  Bottom 0.203: C11.2 17.09,30.35 v17.07,30.33
N$15  (via drill 0.3)
  Top 0.203: v10.06,23.16 8.61,23.16 R1.2 | R2.2 7.16,29.11 9.3,26.98 9.3,24.99 v9.14,24.84
  Bottom 0.203: IC3.7 7.58,20.57 7.01,20.57 6.86,20.73 6.86,21.79 7.16,22.1 8.08,22.1 8.41,21.77 IC3.8 8.38,21.37 8.38,21.95 8.53,22.1 8.69,22.1 8.91,21.88 IC3.9 8.91,22.47 9.6,23.16 v10.06,23.16 10.06,24.54 9.75,24.84 v9.14,24.84
N$16
  Bottom 0.203: R12.1 31,4.2 30.63,4.57 30.63,5.58 U$2.3
N$17
  Bottom 0.203: R13.2 30,31.38 U$2.4
N$19  (via drill 0.3)
  Top 0.254: R9.1 21.08,2.24 R10.2 21,3.96 v19.51,3.96 19.51,2.59 19.36,2.44 17.68,2.44 17.56,2.55 U1.3 | C5.2 24,3.89 v23.93,3.96
  Bottom 0.254: v23.93,3.96 v19.51,3.96
N$20  (via drill 0.3)
  Top 0.203: IC1.59 29,19.25 v29.11,19.36
  Bottom 0.203: R7.2 R6.1 v29.11,19.36
N$21
  Bottom 0.203: IC3.28 8.41,15.71 C12.2
N$23
  Top 0.406: Q1.2 38.7,35.95 R15.1
N$24
  Top 0.406: R14.2 R15.2 38.7,34.05 Q1.1
N$25  (via drill 0.3)
  Top 0.203: IC1.19 15.52,20.75 18.44,17.83 18.44,17.37 18.29,17.22 v17.98,17.22 | v6.86,26.06 6.86,25.45 5.79,24.38 1.22,24.38 0.76,24.84 0.76,25.3 0.91,25.45 1.94,25.45 R8.2
  Bottom 0.203: v17.98,17.22 17.98,17.68 12.19,23.47 11.28,23.47 10.82,23.93 10.82,25.45 10.21,26.06 v6.86,26.06
NETL
  Top 0.203: U$1.P$51 56.95,37.08 56.69,37.34 41.6,37.34 41,36.73 R14.1
NTC  (via drill 0.3)
  Top 0.203: U$1.P$73 35.08,17.65 v34.75,17.98 | v34.75,13.41 34.75,12.8 34.59,12.65 33.07,12.65 32.92,12.8 32.46,12.8 32.16,12.5 27.58,12.5 27.43,12.34 27.43,6.4 26.98,5.94 23.93,5.94 23.01,6.86 20.27,6.86 20.12,6.71 20.12,5.64 19.51,5.03 v19.05,5.03
  Bottom 0.203: v34.75,17.98 v34.75,13.41 | v19.05,5.03 15.7,5.03 15.09,4.42 12.19,4.42 9.6,1.83 9.6,1.68 8.69,0.76 5.79,0.76 5.49,1.07 5.49,2.34 LIBATRY.2
PWRKEY
  Top 0.203: U$1.P$3 49.95,6.74 49.84,6.86 43.28,6.86 41.45,5.03 40.31,5.03 Q2.3
RESET  (via drill 0.3)
  Top 0.203: v22.71,19.51 23.01,19.2 23.01,18.9 23.16,18.75 IC1.58 27.44,18.75 R5.1
  Bottom 0.203: v22.71,19.51 22.25,19.51 21.64,18.9 20.42,18.9 11.28,28.04 11.28,32.77 12.34,33.83 12.34,35.23 PROG.5 12.65,35.53 12.65,36.73 12.19,37.19 1.68,37.19 1.37,36.88 1.37,32.92 1.52,32.77 1.68,32.77 3.66,30.79 3.66,13.26 4.12,12.8 7.47,12.8 7.97,13.3 C12.1
SIM_CLK  (via drill 0.3)
  Top 0.203: v32.77,1.98 64.92,1.98 65.99,3.05 65.99,5.11 U$1.P$19
  Bottom 0.203: R12.2 32.13,1.35 v32.77,1.98
SIM_DATA  (via drill 0.3)
  Top 0.203: U$1.P$17 63.95,6.92 63.55,7.32 47.7,7.32 45.11,9.91 45.11,24.99 45.57,25.45 45.57,29.72 46.02,30.18 v46.79,30.18
  Bottom 0.203: v46.79,30.18 32.46,30.18 31.39,31.24 31.39,35.2 30.94,35.66 30.01,35.66 R13.1 C8.2
SIM_RST  (via drill 0.3)
  Top 0.203: v29.11,2.44 29.57,1.98 29.87,1.98 30.33,2.44 32.31,2.44 32.46,2.59 33.07,2.59 33.22,2.44 64.47,2.44 65.08,3.05 65.08,5.03 U$1.P$18
  Bottom 0.203: R11.2 28.32,1.35 29.11,2.13 v29.11,2.44
SIM_VDD  (via drill 0.3)
  Top 0.203: v26,4.17 26,2.19 26.67,1.52 30.33,1.52 30.48,1.68 32.16,1.68 32.46,1.37 33.07,1.37 33.22,1.52 65.84,1.52 67.06,2.74 67.06,5.04 U$1.P$20
  Bottom 0.203: C7.2 v26,4.17 25.6,4.57 25.6,5.56 U$2.1
UART0_RXD  (via drill 0.3)
  Top 0.203: v9.6,13.72 9.6,11.43 10.06,10.97 16,10.97 16.31,11.28 16.31,12.34 IC1.33
  Bottom 0.203: IC3.26 9.41,13.91 v9.6,13.72
UART0_TXD  (via drill 0.3)
  Top 0.203: IC1.32 10.29,14.25 v10.06,14.48
  Bottom 0.203: v10.06,14.48 10.06,14.78 9.91,14.94 IC3.25
UART1_RXD  (via drill 0.3)
  Top 0.203: IC1.35 17.25,10.79 17.98,10.06 17.98,9.45 18.14,9.3 v18.14,8.38 | v34.59,19.51 40.84,19.51 41,19.66 U$1.P$71
  Bottom 0.203: v18.14,8.38 18.44,8.38 18.59,8.53 31.85,8.53 33.98,10.67 33.98,18.9 v34.59,19.51
UART1_TXD  (via drill 0.3)
  Top 0.203: IC1.34 16.75,10.68 17.53,9.91 v17.53,8.99 | v33.53,22.25 33.98,22.71 39.47,22.71 39.62,22.55 40.23,22.55 40.39,22.71 42.39,22.71 U$1.P$68
  Bottom 0.203: v17.53,8.99 31.7,8.99 33.53,10.82 v33.53,22.25
USB_N  (via drill 0.3)
  Top 0.203: JP1.D- 5.9,19.7 v6.1,19.51
  Bottom 0.203: v6.1,19.51 7.56,19.51 IC3.5
USB_P  (via drill 0.3)
  Top 0.203: JP1.D+ v5.18,19.05
  Bottom 0.203: v5.18,19.05 5.33,19.05 5.49,18.9 6.55,18.9 6.71,19.05 IC3.4
VBAT  (via drill 0.3)
  Top 0.254: U1.5 16.91,5.79 17.07,5.94 17.37,5.94 | 17.37,5.94 17.53,5.79 17.53,5.24 U1.4 | 17.37,5.94 v19.2,5.94
  Top 0.406: v19.2,5.94 v19.2,9.75 | v32.77,12.04 37.49,12.04 37.95,12.5 37.95,13.7 C4.+ 38.12,13.87 v35.66,13.87 | R16.2 31,31.79 33.22,29.57 35.05,29.57 35.51,29.11 35.51,24.23 v35.2,23.93 36.28,25 C3.+ 38.25,28.34 38.56,28.65 40.69,28.65 | U$1.P$63 40.78,27.65 40.39,28.04 40.39,28.35 40.69,28.65 | 40.69,28.65 U$1.P$62
  Bottom 0.254: v19.2,5.94 16,5.94 14.94,4.88 12.04,4.88 9.6,2.44 8.07,2.44 LIBATRY.1
  Bottom 0.406: v19.2,9.75 31.55,9.75 32.77,10.97 v32.77,12.04 | v35.66,13.87 35.66,20.73 35.2,21.18 v35.2,23.93 34.9,24.23 33.07,24.23 31.74,22.9 R6.2
VBUS  (via drill 0.3)
  Top 0.203: R1.1 7.16,23.01 5.79,23.01 5.33,22.55 5.33,20.57 5.11,20.35 JP1.VBUS 3.92,22.14 v2.9,23.16
  Top 0.406: U$1.P$74 32.04,16.65 v32,16.61 | v23.62,15.7 v18.14,15.7 | v11.12,15.24 11.12,23.16 10.21,24.08 7.62,24.08 7.32,23.77 7.32,23.17 R1.1
  Bottom 0.203: v2.9,23.16 2.9,20.88 2.59,20.57 2.08,20.57 C1.2
  Bottom 0.406: v32,16.61 24.54,16.61 v23.62,15.7 | v18.14,15.7 12.8,15.7 12.34,15.24 v11.12,15.24
VDD  (via drill 0.3)
  Top 0.203: IC1.10 19.25,22.05 v19.36,21.95 19.66,21.64 23.47,21.64 23.75,21.92 IC1.1 23.77,23.62 23.77,24.69 | v12.04,30.48 0.76,30.48 0.61,30.33 v0.61,29.72 | LED2.C 1.99,26.36 0.76,26.36 0.61,26.52 v0.61,26.82 | IC1.64 26.78,21.75 27.13,22.1 27.13,23.62 | 27.13,23.62 27.13,23.77 | 27.13,23.77 27.13,24.69 26.82,24.99 24.08,24.99 23.77,24.69 | C9.2 24.17,26 23.77,25.6 23.77,24.69 | C10.2 28,22.75 27.13,23.62 | 28,15.74 28,15.43 v28.04,15.39 | R5.2 28.48,16.89 v29.11,17.53 | v26.36,23.32 26.36,23.62 26.52,23.77 27.13,23.77
  Top 0.254: U1.2 16.91,2.29 17.37,1.83 17.37,1.52 | 17.37,1.52 17.37,1.28 L2.2 21.02,1 R9.2 23.55,0.91 C5.1 23.98,1.37 22.86,1.37 22.55,1.68 22.55,4.72 23.32,5.49 27.43,5.49 28.04,6.1 v28.04,11.73 | R5.2 28,15.74 | C6.1 14.3,1.35 14.94,1.98 16.92,1.98 17.37,1.52
  Bottom 0.203: v19.36,21.95 19.05,21.64 18.29,21.64 11.73,28.19 11.73,30.18 v12.04,30.48 | v29.11,17.53 27.89,17.53 27.43,17.98 27.43,21.64 26.36,22.71 v26.36,23.32 | 0.46,27.13 0.61,26.98 v0.61,26.82 0.46,26.98 0.46,29.26 0.61,29.41 v0.61,29.72
  Bottom 0.254: v28.04,15.39 v28.04,11.73
VRTC  (via drill 0.3)
  Top 0.203: v46.48,9.75 45.87,9.75 45.57,10.06 45.57,24.84 46.02,25.3 46.02,29.26 46.33,29.57 47.09,29.57 47.4,29.87 48.01,29.87 49.38,31.24 54.86,31.24 56.54,32.92 65.38,32.92 65.99,33.53 65.99,35.11 U$1.P$42
  Bottom 0.203: v46.48,9.75 46.33,9.6 38.56,9.6 37.95,10.21 37.95,11.28 37.34,11.89 34.9,11.89 34.44,11.43 34.44,10.52 32,8.08 18.75,8.08 18.44,7.77 17.83,7.77 17.42,8.18 G1.+@2 15.09,7.81 15.09,5.79 14.63,5.33 2.44,5.33 2.25,5.52 G1.+@1